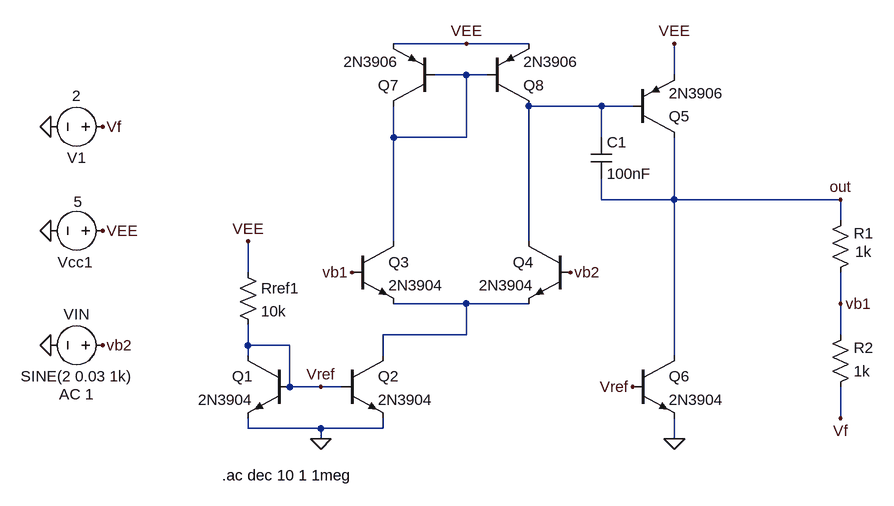
[diagram p0: schematic amp-op-bjt-feedback.asc]
amp-op-bjt-feedback.asc, the LTspice schematic file:
Version 4.1
SHEET 1 968 680
WIRE 176 -192 64 -192
WIRE 272 -192 176 -192
WIRE 176 -144 128 -144
WIRE 208 -144 176 -144
WIRE 496 -144 496 -192
WIRE 384 -96 272 -96
WIRE 432 -96 384 -96
WIRE 64 -48 64 -96
WIRE 176 -48 176 -144
WIRE 176 -48 64 -48
WIRE 384 -48 384 -96
WIRE 384 48 384 16
WIRE 496 48 496 -48
WIRE 496 48 384 48
WIRE 752 48 496 48
WIRE 752 80 752 48
WIRE 64 112 64 -48
WIRE 272 112 272 -96
WIRE -160 160 -160 112
WIRE 176 208 64 208
WIRE 272 208 176 208
WIRE 752 208 752 160
WIRE 176 256 176 208
WIRE 176 256 48 256
WIRE 752 256 752 208
WIRE -160 272 -160 240
WIRE -96 272 -160 272
WIRE -160 288 -160 272
WIRE 48 288 48 256
WIRE 496 288 496 48
WIRE -96 336 -96 272
WIRE -48 336 -96 336
WIRE -16 336 -48 336
WIRE 752 384 752 336
WIRE -160 400 -160 384
WIRE -48 400 -160 400
WIRE 48 400 48 384
WIRE 48 400 -48 400
WIRE -48 416 -48 400
WIRE 496 416 496 384
FLAG -48 416 0
FLAG -464 96 0
FLAG -464 272 0
FLAG -384 96 VEE
FLAG 496 -192 VEE
FLAG -160 112 VEE
FLAG 752 48 out
FLAG 496 416 0
FLAG 176 -192 VEE
FLAG -384 272 vb2
FLAG 0 160 vb1
FLAG 336 160 vb2
FLAG 752 208 vb1
FLAG 432 336 Vref
FLAG -48 336 Vref
FLAG 752 384 Vf
FLAG -464 -64 0
FLAG -384 -64 Vf
SYMBOL res -176 144 R0
SYMATTR InstName Rref1
SYMATTR Value 10k
SYMBOL npn -96 288 M0
SYMATTR InstName Q1
SYMATTR Value 2N3904
SYMBOL npn -16 288 R0
SYMATTR InstName Q2
SYMATTR Value 2N3904
SYMBOL voltage -368 96 R90
WINDOW 0 48 32 VRight 2
WINDOW 3 -45 47 VRight 2
WINDOW 123 0 0 Left 0
WINDOW 39 0 0 Left 0
SYMATTR InstName Vcc1
SYMATTR Value 5
SYMBOL npn 0 112 R0
SYMATTR InstName Q3
SYMATTR Value 2N3904
SYMBOL npn 336 112 M0
SYMATTR InstName Q4
SYMATTR Value 2N3904
SYMBOL voltage -368 272 R90
WINDOW 0 -32 56 VBottom 2
WINDOW 3 32 56 VTop 2
WINDOW 123 60 56 VTop 2
WINDOW 39 0 0 Left 0
SYMATTR InstName VIN
SYMATTR Value SINE(2 0.03 1k)
SYMATTR Value2 AC 1
SYMBOL pnp 432 -48 M180
SYMATTR InstName Q5
SYMATTR Value 2N3906
SYMBOL npn 432 288 R0
SYMATTR InstName Q6
SYMATTR Value 2N3904
SYMBOL pnp 128 -96 R180
SYMATTR InstName Q7
SYMATTR Value 2N3906
SYMBOL pnp 208 -96 M180
SYMATTR InstName Q8
SYMATTR Value 2N3906
SYMBOL res 736 176 M180
WINDOW 0 36 76 Left 2
WINDOW 3 39 48 Left 2
SYMATTR InstName R1
SYMATTR Value 1k
SYMBOL res 736 352 M180
WINDOW 0 36 76 Left 2
WINDOW 3 36 40 Left 2
SYMATTR InstName R2
SYMATTR Value 1k
SYMBOL voltage -368 -64 R90
WINDOW 0 32 56 VTop 2
WINDOW 3 -32 56 VBottom 2
WINDOW 123 0 0 Left 0
WINDOW 39 0 0 Left 0
SYMATTR InstName V1
SYMATTR Value 2
SYMBOL cap 368 -48 R0
SYMATTR InstName C1
SYMATTR Value 100nF
TEXT -200 472 Left 2 !.ac dec 10 1 1meg

The netlist it stands for:
* amp-op-bjt-feedback.asc
Rref1 VEE Vref 10k
Q1 Vref Vref 0 0 2N3904
Q2 N003 Vref 0 0 2N3904
Vcc1 VEE 0 5
Q3 N001 vb1 N003 0 2N3904
Q4 N002 vb2 N003 0 2N3904
VIN vb2 0 SINE(2 0.03 1k) AC 1
Q5 out N002 VEE 0 2N3906
Q6 out Vref 0 0 2N3904
Q7 N001 N001 VEE 0 2N3906
Q8 N002 N001 VEE 0 2N3906
R1 vb1 out 1k
R2 Vf vb1 1k
V1 Vf 0 2
C1 N002 out 100nF
.model NPN NPN
.model PNP PNP
.lib standard.bjt
.ac dec 10 1 1meg
.backanno
.end